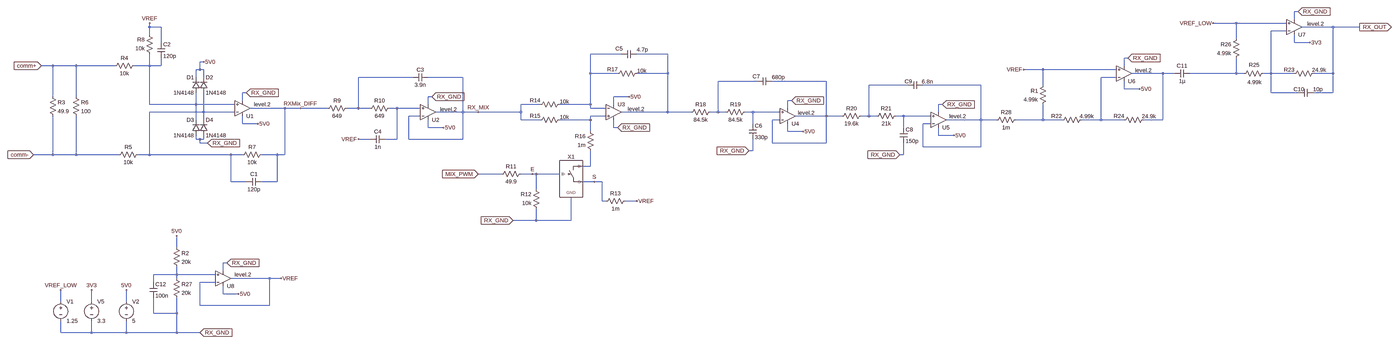
[diagram p0: schematic PLC_RX_Channel_D1288_IDEAL.asc, whole sheet]
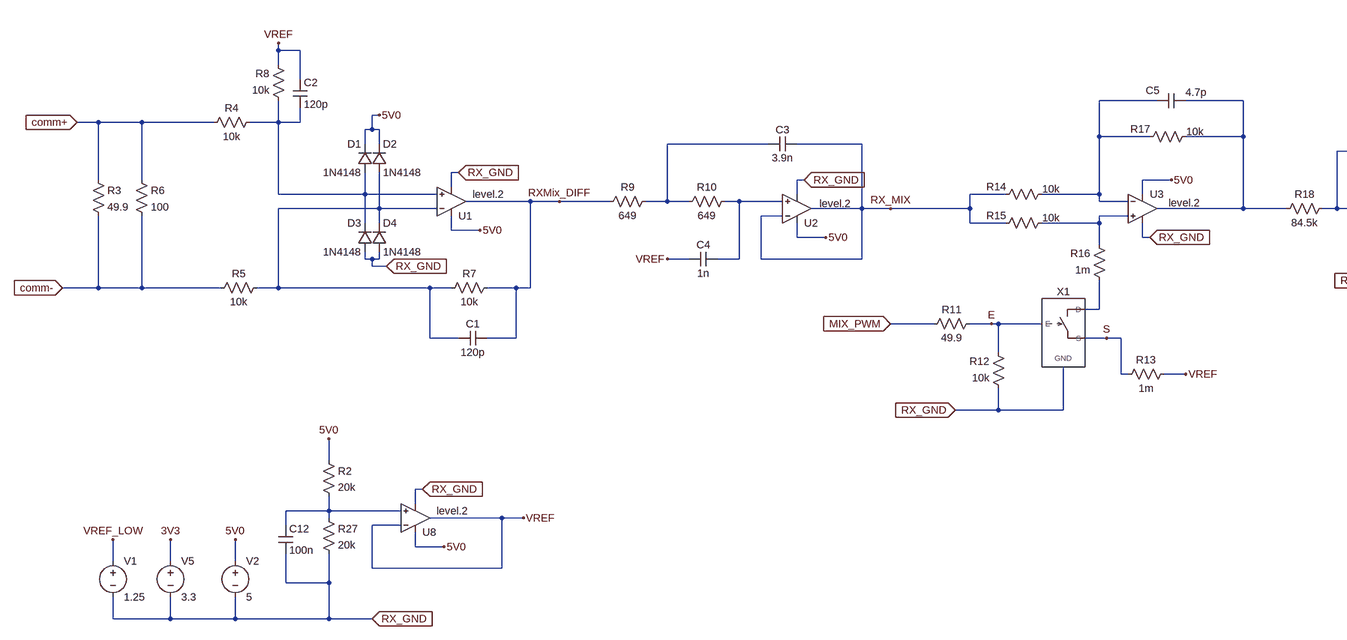
[diagram p1: schematic PLC_RX_Channel_D1288_IDEAL.asc, part, row 1 of 1, column 1 of 2]
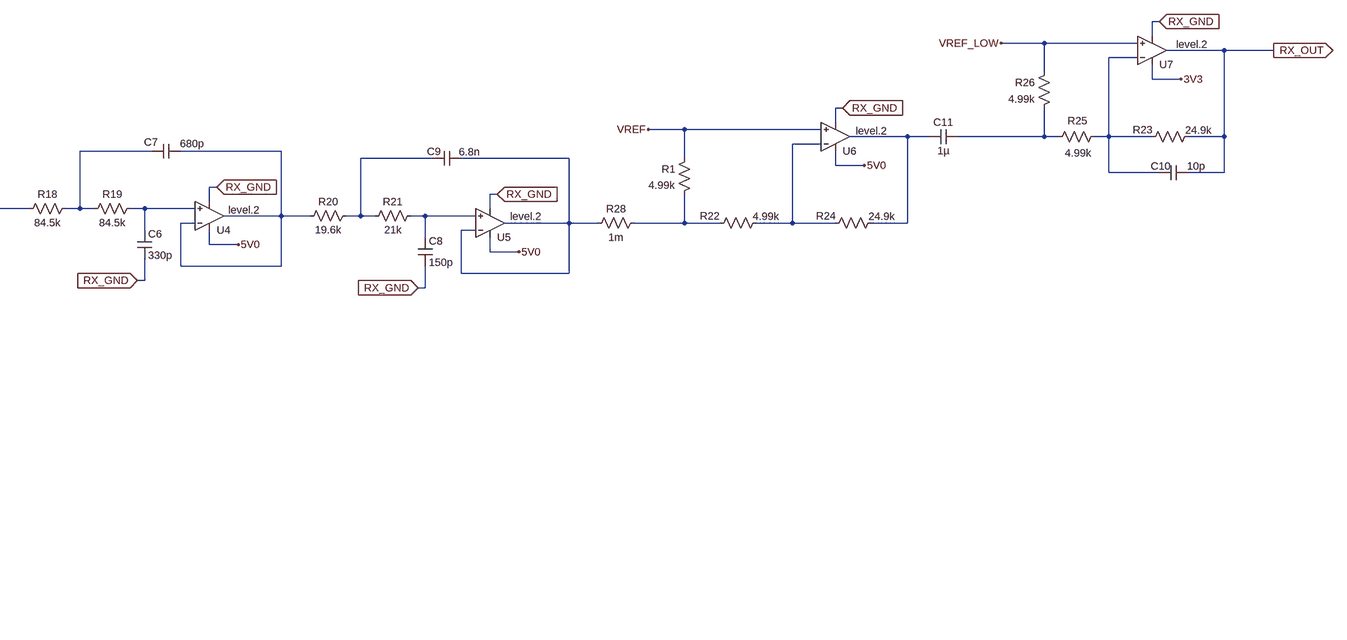
[diagram p2: schematic PLC_RX_Channel_D1288_IDEAL.asc, part, row 1 of 1, column 2 of 2]
PLC_RX_Channel_D1288_IDEAL.asc, the LTspice schematic file:
Version 4
SHEET 1 2104 5400
WIRE 320 -64 304 -64
WIRE 304 -32 304 -64
WIRE 64 -16 -32 -16
WIRE 272 -16 64 -16
WIRE -4432 0 -4432 -16
WIRE -4384 0 -4432 0
WIRE 464 0 336 0
WIRE 608 0 464 0
WIRE 272 16 208 16
WIRE -4432 32 -4432 0
WIRE 64 48 64 -16
WIRE -4384 64 -4384 0
WIRE 304 64 304 32
WIRE 368 64 304 64
WIRE -2480 112 -2608 112
WIRE -2288 112 -2416 112
WIRE -384 128 -400 128
WIRE -4208 144 -4224 144
WIRE -4832 160 -4880 160
WIRE -4736 160 -4832 160
WIRE -4576 160 -4736 160
WIRE -4432 160 -4432 112
WIRE -4432 160 -4496 160
WIRE -4384 160 -4384 128
WIRE -4384 160 -4432 160
WIRE -400 160 -400 128
WIRE -4224 176 -4224 144
WIRE -4224 176 -4240 176
WIRE -4208 176 -4224 176
WIRE -736 176 -816 176
WIRE -432 176 -736 176
WIRE -2608 192 -2608 112
WIRE -2496 192 -2608 192
WIRE -2288 192 -2288 112
WIRE -2288 192 -2416 192
WIRE -240 192 -368 192
WIRE -192 192 -240 192
WIRE 64 192 64 128
WIRE 64 192 -128 192
WIRE 96 192 64 192
WIRE 208 192 208 16
WIRE 208 192 176 192
WIRE 304 192 208 192
WIRE 464 192 464 0
WIRE 464 192 384 192
WIRE -4240 208 -4240 176
WIRE -4208 208 -4208 176
WIRE -3344 208 -3568 208
WIRE -3136 208 -3280 208
WIRE -432 208 -496 208
WIRE -1920 224 -2080 224
WIRE -1632 224 -1856 224
WIRE -1296 240 -1456 240
WIRE -992 240 -1232 240
WIRE -736 240 -736 176
WIRE -400 256 -400 224
WIRE -336 256 -400 256
WIRE -4032 272 -4048 272
WIRE 208 272 208 192
WIRE 320 272 208 272
WIRE 464 272 464 192
WIRE 464 272 384 272
WIRE -4832 288 -4832 160
WIRE -4736 288 -4736 160
WIRE -3264 288 -3280 288
WIRE -2448 288 -2512 288
WIRE -4048 304 -4048 272
WIRE -1776 304 -1792 304
WIRE -4432 320 -4432 160
WIRE -4240 320 -4240 272
WIRE -4240 320 -4432 320
WIRE -4080 320 -4240 320
WIRE -3280 320 -3280 288
WIRE -2816 320 -2896 320
WIRE -2608 320 -2608 192
WIRE -2608 320 -2736 320
WIRE -2512 320 -2512 288
WIRE -1152 320 -1168 320
WIRE -3872 336 -4016 336
WIRE -3808 336 -3872 336
WIRE -3696 336 -3808 336
WIRE -3568 336 -3568 208
WIRE -3568 336 -3616 336
WIRE -3520 336 -3568 336
WIRE -3408 336 -3440 336
WIRE -3312 336 -3408 336
WIRE -2608 336 -2608 320
WIRE -2544 336 -2608 336
WIRE -1792 336 -1792 304
WIRE -4208 352 -4208 272
WIRE -4208 352 -4432 352
WIRE -4080 352 -4208 352
WIRE -3136 352 -3136 208
WIRE -3136 352 -3248 352
WIRE -3072 352 -3136 352
WIRE -2896 352 -2896 320
WIRE -2896 352 -3072 352
WIRE -2288 352 -2288 192
WIRE -2288 352 -2480 352
WIRE -2192 352 -2288 352
WIRE -2080 352 -2080 224
WIRE -2080 352 -2112 352
WIRE -2048 352 -2080 352
WIRE -1936 352 -1968 352
WIRE -1824 352 -1936 352
WIRE -1168 352 -1168 320
WIRE -3312 368 -3360 368
WIRE -2544 368 -2608 368
WIRE -1632 368 -1632 224
WIRE -1632 368 -1760 368
WIRE -1568 368 -1632 368
WIRE -1456 368 -1456 240
WIRE -1456 368 -1488 368
WIRE -1424 368 -1456 368
WIRE -1312 368 -1344 368
WIRE -1200 368 -1312 368
WIRE -4240 384 -4240 320
WIRE -4208 384 -4208 352
WIRE -2896 384 -2896 352
WIRE -2816 384 -2896 384
WIRE -2608 384 -2608 368
WIRE -2608 384 -2736 384
WIRE -1824 384 -1856 384
WIRE -992 384 -992 240
WIRE -992 384 -1136 384
WIRE -928 384 -992 384
WIRE -736 384 -736 320
WIRE -736 384 -848 384
WIRE -656 384 -736 384
WIRE -496 384 -496 208
WIRE -496 384 -576 384
WIRE -400 384 -496 384
WIRE -240 384 -240 192
WIRE -240 384 -320 384
WIRE -4048 400 -4048 368
WIRE -3984 400 -4048 400
WIRE -1936 400 -1936 352
WIRE -1200 400 -1232 400
WIRE -3280 416 -3280 384
WIRE -3216 416 -3280 416
WIRE -2512 416 -2512 384
WIRE -2496 416 -2512 416
WIRE -1312 416 -1312 368
WIRE -2608 432 -2608 384
WIRE -1792 432 -1792 400
WIRE -1728 432 -1792 432
WIRE -1168 448 -1168 416
WIRE -1104 448 -1168 448
WIRE -4240 464 -4240 448
WIRE -4224 464 -4240 464
WIRE -4208 464 -4208 448
WIRE -4208 464 -4224 464
WIRE -3520 464 -3568 464
WIRE -3408 464 -3408 336
WIRE -3408 464 -3456 464
WIRE -3360 464 -3360 368
WIRE -3136 464 -3136 352
WIRE -3136 464 -3360 464
WIRE -4224 480 -4224 464
WIRE -4192 480 -4224 480
WIRE -1856 480 -1856 384
WIRE -1632 480 -1632 368
WIRE -1632 480 -1856 480
WIRE -1232 496 -1232 400
WIRE -992 496 -992 384
WIRE -992 496 -1232 496
WIRE -1936 512 -1936 464
WIRE -1936 512 -1952 512
WIRE -4832 528 -4832 368
WIRE -4832 528 -4912 528
WIRE -4736 528 -4736 368
WIRE -4736 528 -4832 528
WIRE -4560 528 -4736 528
WIRE -4432 528 -4432 352
WIRE -4432 528 -4480 528
WIRE -4096 528 -4432 528
WIRE -4048 528 -4096 528
WIRE -3904 528 -3968 528
WIRE -3872 528 -3872 336
WIRE -3872 528 -3904 528
WIRE -1312 528 -1312 480
WIRE -1312 528 -1328 528
WIRE -2608 576 -2608 512
WIRE -2608 576 -2640 576
WIRE -2976 608 -3072 608
WIRE -2848 608 -2896 608
WIRE -2832 608 -2848 608
WIRE -2736 608 -2832 608
WIRE -4096 640 -4096 528
WIRE -4032 640 -4096 640
WIRE -3904 640 -3904 528
WIRE -3904 640 -3968 640
WIRE -2592 640 -2640 640
WIRE -2560 640 -2592 640
WIRE -2832 672 -2832 608
WIRE -2560 720 -2560 640
WIRE -2544 720 -2560 720
WIRE -2416 720 -2464 720
WIRE -2832 800 -2832 752
WIRE -2832 800 -2928 800
WIRE -2688 800 -2688 704
WIRE -2688 800 -2832 800
WIRE -4320 912 -4320 864
WIRE -4112 976 -4128 976
WIRE -4128 1008 -4128 976
WIRE -4320 1024 -4320 992
WIRE -4320 1024 -4416 1024
WIRE -4160 1024 -4320 1024
WIRE -4320 1040 -4320 1024
WIRE -3936 1040 -4096 1040
WIRE -3888 1040 -3936 1040
WIRE -4416 1056 -4416 1024
WIRE -4160 1056 -4224 1056
WIRE -4128 1104 -4128 1072
WIRE -4064 1104 -4128 1104
WIRE -4800 1136 -4800 1088
WIRE -4672 1136 -4672 1088
WIRE -4528 1136 -4528 1088
WIRE -4224 1152 -4224 1056
WIRE -3936 1152 -3936 1040
WIRE -3936 1152 -4224 1152
WIRE -4416 1184 -4416 1120
WIRE -4320 1184 -4320 1120
WIRE -4320 1184 -4416 1184
WIRE -4800 1264 -4800 1216
WIRE -4672 1264 -4672 1216
WIRE -4672 1264 -4800 1264
WIRE -4528 1264 -4528 1216
WIRE -4528 1264 -4672 1264
WIRE -4320 1264 -4320 1184
WIRE -4320 1264 -4528 1264
WIRE -4224 1264 -4320 1264
FLAG -4800 1088 VREF_LOW
FLAG -4672 1088 3V3
FLAG -4880 160 comm+
IOPIN -4880 160 In
FLAG -4912 528 comm-
IOPIN -4912 528 In
FLAG -4032 272 RX_GND
IOPIN -4032 272 In
FLAG -4432 -16 VREF
FLAG -3808 336 RXMix_DIFF
FLAG -3264 288 RX_GND
IOPIN -3264 288 In
FLAG -3568 464 VREF
FLAG -3072 352 RX_MIX
FLAG -3072 608 MIX_PWM
IOPIN -3072 608 In
FLAG -2848 608 E
FLAG -2592 640 S
FLAG -2416 720 VREF
FLAG -2928 800 RX_GND
IOPIN -2928 800 In
FLAG -2496 416 RX_GND
IOPIN -2496 416 In
FLAG -1776 304 RX_GND
IOPIN -1776 304 In
FLAG -1952 512 RX_GND
IOPIN -1952 512 In
FLAG -1152 320 RX_GND
IOPIN -1152 320 In
FLAG -1328 528 RX_GND
IOPIN -1328 528 In
FLAG -384 128 RX_GND
IOPIN -384 128 In
FLAG -816 176 VREF
FLAG 320 -64 RX_GND
IOPIN 320 -64 In
FLAG 368 64 3V3
FLAG -32 -16 VREF_LOW
FLAG 608 0 RX_OUT
IOPIN 608 0 Out
FLAG -4224 1264 RX_GND
IOPIN -4224 1264 In
FLAG -4528 1088 5V0
FLAG -3984 400 5V0
FLAG -3216 416 5V0
FLAG -2448 288 5V0
FLAG -1728 432 5V0
FLAG -1104 448 5V0
FLAG -336 256 5V0
FLAG -3888 1040 VREF
FLAG -4112 976 RX_GND
IOPIN -4112 976 In
FLAG -4064 1104 5V0
FLAG -4320 864 5V0
FLAG -4208 144 5V0
FLAG -4192 480 RX_GND
IOPIN -4192 480 In
DATAFLAG -4432 320 ""
DATAFLAG 208 -16 ""
SYMBOL voltage -4800 1120 R0
WINDOW 123 0 0 Left 2
WINDOW 39 0 0 Left 2
SYMATTR InstName V1
SYMATTR Value 1.25
SYMBOL Opamps\\UniversalOpamp2 -4048 336 M180
WINDOW 38 47 16 Left 2
SYMATTR InstName U1
SYMBOL voltage -4672 1120 R0
WINDOW 123 0 0 Left 2
WINDOW 39 0 0 Left 2
SYMATTR InstName V5
SYMATTR Value 3.3
SYMBOL res -4848 272 R0
SYMATTR InstName R3
SYMATTR Value 49.9
SYMBOL res -4480 144 R90
WINDOW 0 0 56 VBottom 2
WINDOW 3 32 56 VTop 2
SYMATTR InstName R4
SYMATTR Value 10k
SYMBOL res -4464 512 R90
WINDOW 0 0 56 VBottom 2
WINDOW 3 32 56 VTop 2
SYMATTR InstName R5
SYMATTR Value 10k
SYMBOL res -4752 272 R0
SYMATTR InstName R6
SYMATTR Value 100
SYMBOL res -3952 512 R90
WINDOW 0 0 56 VBottom 2
WINDOW 3 32 56 VTop 2
SYMATTR InstName R7
SYMATTR Value 10k
SYMBOL cap -3968 624 R90
WINDOW 0 0 32 VBottom 2
WINDOW 3 32 32 VTop 2
SYMATTR InstName C1
SYMATTR Value 120p
SYMBOL res -4416 128 R180
WINDOW 0 36 76 Left 2
WINDOW 3 36 40 Left 2
SYMATTR InstName R8
SYMATTR Value 10k
SYMBOL cap -4400 64 R0
SYMATTR InstName C2
SYMATTR Value 120p
SYMBOL Opamps\\UniversalOpamp2 -3280 352 M180
WINDOW 38 50 11 Left 2
SYMATTR InstName U2
SYMBOL res -3600 320 R90
WINDOW 0 0 56 VBottom 2
WINDOW 3 32 56 VTop 2
SYMATTR InstName R9
SYMATTR Value 649
SYMBOL res -3424 320 R90
WINDOW 0 0 56 VBottom 2
WINDOW 3 32 56 VTop 2
SYMATTR InstName R10
SYMATTR Value 649
SYMBOL cap -3280 192 R90
WINDOW 0 0 32 VBottom 2
WINDOW 3 32 32 VTop 2
SYMATTR InstName C3
SYMATTR Value 3.9n
SYMBOL cap -3456 448 R90
WINDOW 0 0 32 VBottom 2
WINDOW 3 32 32 VTop 2
SYMATTR InstName C4
SYMATTR Value 1n
SYMBOL res -2880 592 R90
WINDOW 0 0 56 VBottom 2
WINDOW 3 32 56 VTop 2
SYMATTR InstName R11
SYMATTR Value 49.9
SYMBOL res -2816 768 R180
WINDOW 0 36 76 Left 2
WINDOW 3 36 40 Left 2
SYMATTR InstName R12
SYMATTR Value 10k
SYMBOL Analog_Switch -2688 608 R0
SYMATTR InstName X1
SYMBOL res -2448 704 R90
WINDOW 0 0 56 VBottom 2
WINDOW 3 32 56 VTop 2
SYMATTR InstName R13
SYMATTR Value 1m
SYMBOL res -2720 304 R90
WINDOW 0 15 117 VBottom 2
WINDOW 3 -11 -5 VTop 2
SYMATTR InstName R14
SYMATTR Value 10k
SYMBOL res -2720 368 R90
WINDOW 0 15 117 VBottom 2
WINDOW 3 -11 -5 VTop 2
SYMATTR InstName R15
SYMATTR Value 10k
SYMBOL res -2592 528 R180
WINDOW 0 36 76 Left 2
WINDOW 3 36 40 Left 2
SYMATTR InstName R16
SYMATTR Value 1m
SYMBOL Opamps\\UniversalOpamp2 -2512 352 R0
WINDOW 38 58 -13 Left 2
SYMATTR InstName U3
SYMBOL res -2400 176 R90
WINDOW 0 15 117 VBottom 2
WINDOW 3 -11 -5 VTop 2
SYMATTR InstName R17
SYMATTR Value 10k
SYMBOL cap -2416 96 R90
WINDOW 0 9 73 VBottom 2
WINDOW 3 -18 -23 VTop 2
SYMATTR InstName C5
SYMATTR Value 4.7p
SYMBOL res -2096 336 R90
WINDOW 0 0 56 VBottom 2
WINDOW 3 32 56 VTop 2
SYMATTR InstName R18
SYMATTR Value 84.5k
SYMBOL res -1952 336 R90
WINDOW 0 0 56 VBottom 2
WINDOW 3 32 56 VTop 2
SYMATTR InstName R19
SYMATTR Value 84.5k
SYMBOL Opamps\\UniversalOpamp2 -1792 368 M180
WINDOW 38 42 13 Left 2
SYMATTR InstName U4
SYMBOL cap -1952 400 R0
SYMATTR InstName C6
SYMATTR Value 330p
SYMBOL cap -1856 208 R90
WINDOW 0 12 66 VBottom 2
WINDOW 3 -16 -26 VTop 2
SYMATTR InstName C7
SYMATTR Value 680p
SYMBOL res -1472 352 R90
WINDOW 0 0 56 VBottom 2
WINDOW 3 32 56 VTop 2
SYMATTR InstName R20
SYMATTR Value 19.6k
SYMBOL res -1328 352 R90
WINDOW 0 0 56 VBottom 2
WINDOW 3 32 56 VTop 2
SYMATTR InstName R21
SYMATTR Value 21k
SYMBOL Opamps\\UniversalOpamp2 -1168 384 M180
WINDOW 38 45 15 Left 2
SYMATTR InstName U5
SYMBOL cap -1328 416 R0
SYMATTR InstName C8
SYMATTR Value 150p
SYMBOL cap -1232 224 R90
WINDOW 0 17 61 VBottom 2
WINDOW 3 -14 -18 VTop 2
SYMATTR InstName C9
SYMATTR Value 6.8n
SYMBOL Opamps\\UniversalOpamp2 -400 192 M180
WINDOW 38 45 13 Left 2
SYMATTR InstName U6
SYMBOL res -416 400 R270
WINDOW 0 16 -5 VTop 2
WINDOW 3 46 119 VBottom 2
SYMATTR InstName R24
SYMATTR Value 24.9k
SYMBOL res -672 400 R270
WINDOW 0 16 -7 VTop 2
WINDOW 3 46 118 VBottom 2
SYMATTR InstName R22
SYMATTR Value 4.99k
SYMBOL Opamps\\UniversalOpamp2 304 0 M180
WINDOW 38 54 13 Left 2
SYMATTR InstName U7
SYMBOL res 288 208 R270
WINDOW 0 16 -5 VTop 2
WINDOW 3 46 119 VBottom 2
SYMATTR InstName R23
SYMATTR Value 24.9k
SYMBOL cap 384 256 R90
WINDOW 0 17 61 VBottom 2
WINDOW 3 -14 -18 VTop 2
SYMATTR InstName C10
SYMATTR Value 10p
SYMBOL cap -128 176 R90
WINDOW 0 0 32 VBottom 2
WINDOW 3 32 32 VTop 2
SYMATTR InstName C11
SYMATTR Value 1µ
SYMBOL res 80 208 R270
WINDOW 0 36 58 VTop 2
WINDOW 3 -5 60 VBottom 2
SYMATTR InstName R25
SYMATTR Value 4.99k
SYMBOL res 80 32 M0
SYMATTR InstName R26
SYMATTR Value 4.99k
SYMBOL res -720 224 M0
SYMATTR InstName R1
SYMATTR Value 4.99k
SYMBOL voltage -4528 1120 R0
WINDOW 123 0 0 Left 2
WINDOW 39 0 0 Left 2
SYMATTR InstName V2
SYMATTR Value 5
SYMBOL Opamps\\UniversalOpamp2 -4128 1040 M180
WINDOW 38 47 16 Left 2
SYMATTR InstName U8
SYMBOL res -4336 896 R0
SYMATTR InstName R2
SYMATTR Value 20k
SYMBOL res -4336 1024 R0
SYMATTR InstName R27
SYMATTR Value 20k
SYMBOL cap -4432 1056 R0
SYMATTR InstName C12
SYMATTR Value 100n
SYMBOL diode -4224 272 R180
WINDOW 0 24 64 Left 2
WINDOW 3 24 0 Left 2
SYMATTR InstName D1
SYMATTR Value 1N4148
SYMBOL diode -4224 272 M180
WINDOW 0 24 64 Left 2
WINDOW 3 24 0 Left 2
SYMATTR InstName D2
SYMATTR Value 1N4148
SYMBOL diode -4224 448 R180
WINDOW 0 24 64 Left 2
WINDOW 3 24 0 Left 2
SYMATTR InstName D3
SYMATTR Value 1N4148
SYMBOL diode -4224 448 M180
WINDOW 0 24 64 Left 2
WINDOW 3 24 0 Left 2
SYMATTR InstName D4
SYMATTR Value 1N4148
SYMBOL res -832 368 R90
WINDOW 0 0 56 VBottom 2
WINDOW 3 32 56 VTop 2
SYMATTR InstName R28
SYMATTR Value 1m

The netlist it stands for:
* PLC_RX_Channel_D1288_IDEAL.asc
V1 VREF_LOW RX_GND 1.25
XU1 N004 N014 5V0 RX_GND RXMix_DIFF level.2 Avol=1Meg GBW=10Meg Slew=10Meg ilimit=25m rail=0 Vos=0 phimargin=45 en=0 enk=0 in=0 ink=0 Rin=500Meg  ; pins IN+ IN- V+ V- OUT
V5 3V3 RX_GND 3.3
R3 comm+ comm- 49.9
R4 N004 comm+ 10k
R5 N014 comm- 10k
R6 comm+ comm- 100
R7 RXMix_DIFF N014 10k
C1 RXMix_DIFF N014 120p
R8 N004 VREF 10k
C2 VREF N004 120p
XU2 N013 RX_MIX 5V0 RX_GND RX_MIX level.2 Avol=1Meg GBW=10Meg Slew=10Meg ilimit=25m rail=0 Vos=0 phimargin=45 en=0 enk=0 in=0 ink=0 Rin=500Meg  ; pins IN+ IN- V+ V- OUT
R9 N007 RXMix_DIFF 649
R10 N013 N007 649
C3 RX_MIX N007 3.9n
C4 N013 VREF 1n
R11 E MIX_PWM 49.9
R12 RX_GND E 10k
XX1 E RX_GND S N019 Analog_Switch  ; pins E GND S D
R13 VREF S 1m
R14 N002 RX_MIX 10k
R15 N016 RX_MIX 10k
R16 N019 N016 1m
XU3 N016 N002 5V0 RX_GND N003 level.2 Avol=1Meg GBW=10Meg Slew=10Meg ilimit=25m rail=0 Vos=0 phimargin=45 en=0 enk=0 in=0 ink=0 Rin=500Meg  ; pins IN+ IN- V+ V- OUT
R17 N003 N002 10k
C5 N003 N002 4.7p
R18 N009 N003 84.5k
R19 N015 N009 84.5k
XU4 N015 N010 5V0 RX_GND N010 level.2 Avol=1Meg GBW=10Meg Slew=10Meg ilimit=25m rail=0 Vos=0 phimargin=45 en=0 enk=0 in=0 ink=0 Rin=500Meg  ; pins IN+ IN- V+ V- OUT
C6 N015 RX_GND 330p
C7 N010 N009 680p
R20 N011 N010 19.6k
R21 N017 N011 21k
XU5 N017 N012 5V0 RX_GND N012 level.2 Avol=1Meg GBW=10Meg Slew=10Meg ilimit=25m rail=0 Vos=0 phimargin=45 en=0 enk=0 in=0 ink=0 Rin=500Meg  ; pins IN+ IN- V+ V- OUT
C8 N017 RX_GND 150p
C9 N012 N011 6.8n
XU6 VREF N008 5V0 RX_GND N005 level.2 Avol=1Meg GBW=10Meg Slew=10Meg ilimit=25m rail=0 Vos=0 phimargin=45 en=0 enk=0 in=0 ink=0 Rin=500Meg  ; pins IN+ IN- V+ V- OUT
R24 N008 N005 24.9k
R22 N018 N008 4.99k
XU7 VREF_LOW N001 3V3 RX_GND RX_OUT level.2 Avol=1Meg GBW=10Meg Slew=10Meg ilimit=25m rail=0 Vos=0 phimargin=45 en=0 enk=0 in=0 ink=0 Rin=500Meg  ; pins IN+ IN- V+ V- OUT
R23 N001 RX_OUT 24.9k
C10 RX_OUT N001 10p
C11 N006 N005 1µ
R25 N006 N001 4.99k
R26 VREF_LOW N006 4.99k
R1 VREF N018 4.99k
V2 5V0 RX_GND 5
XU8 N020 VREF 5V0 RX_GND VREF level.2 Avol=1Meg GBW=10Meg Slew=10Meg ilimit=25m rail=0 Vos=0 phimargin=45 en=0 enk=0 in=0 ink=0 Rin=500Meg  ; pins IN+ IN- V+ V- OUT
R2 5V0 N020 20k
R27 N020 RX_GND 20k
C12 N020 RX_GND 100n
D1 N004 5V0 1N4148
D2 N014 5V0 1N4148
D3 RX_GND N004 1N4148
D4 RX_GND N014 1N4148
R28 N018 N012 1m
.model D D
.lib standard.dio
.lib UniversalOpamps2.sub
.backanno
.end